# EAGLE board dw08a (EAGLE 6.6.0), part 1 of 4
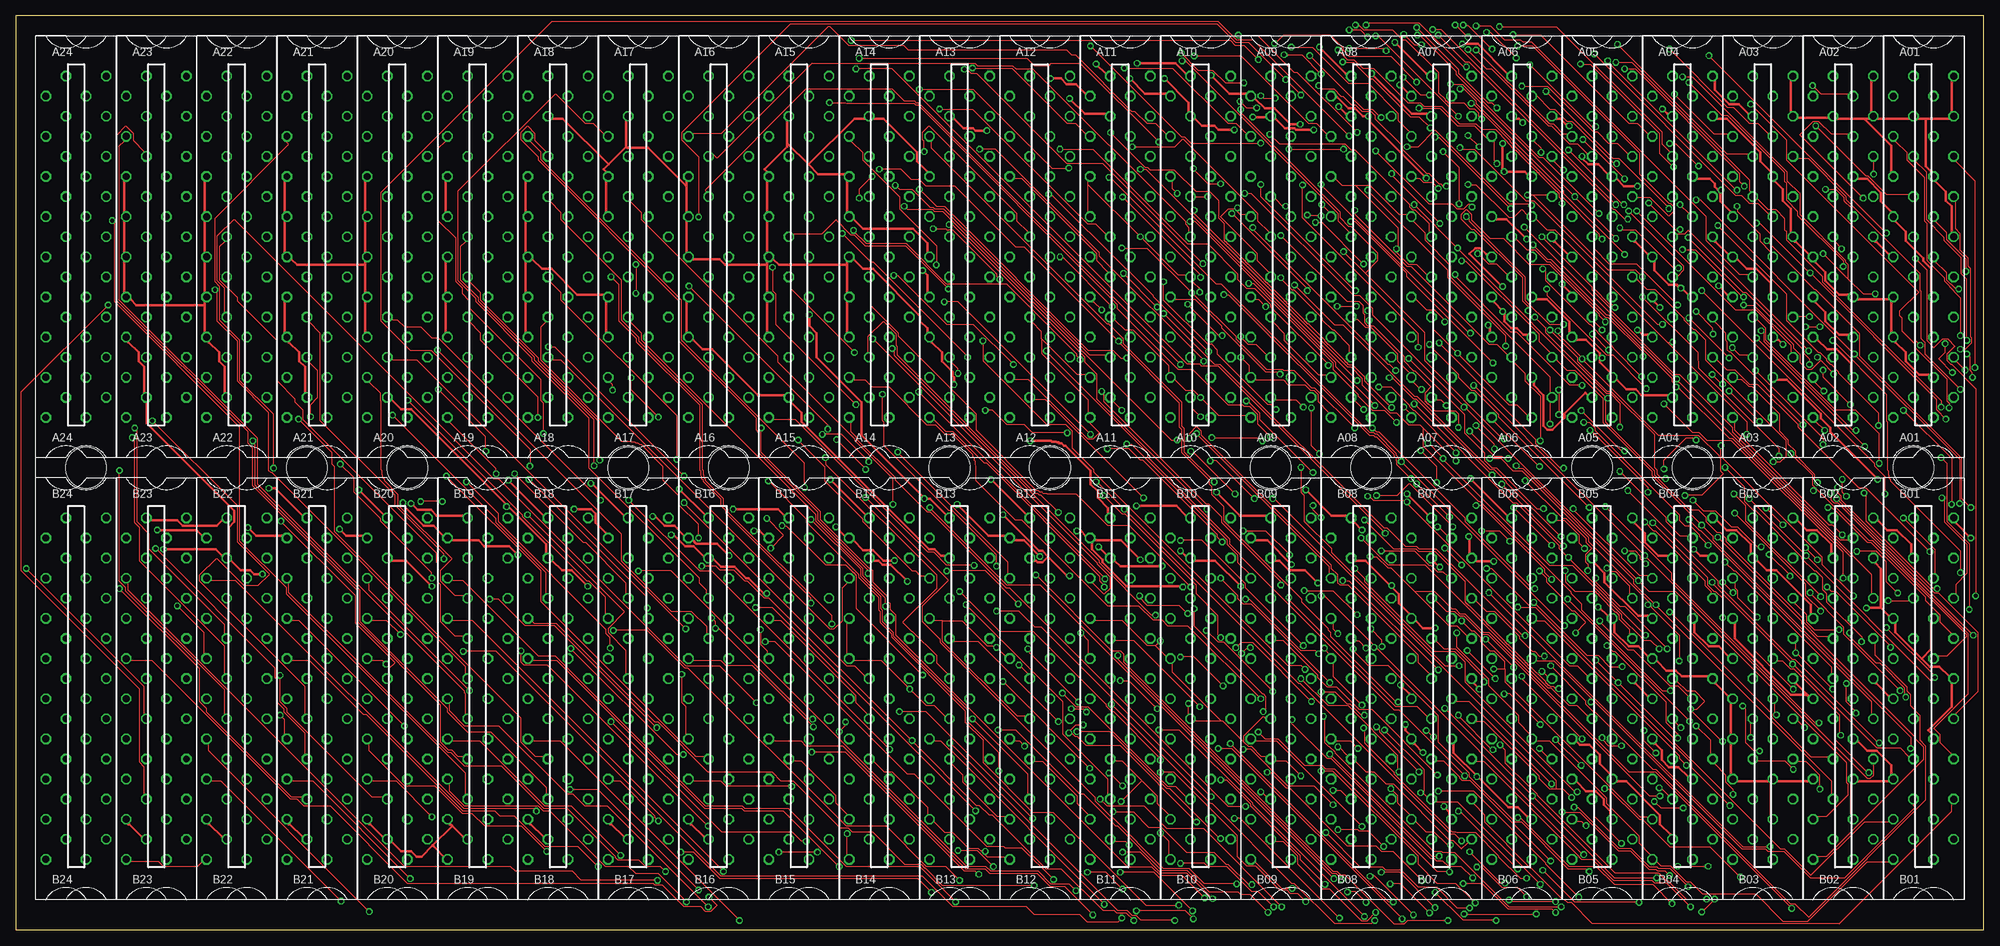
[diagram p6: board, top side]
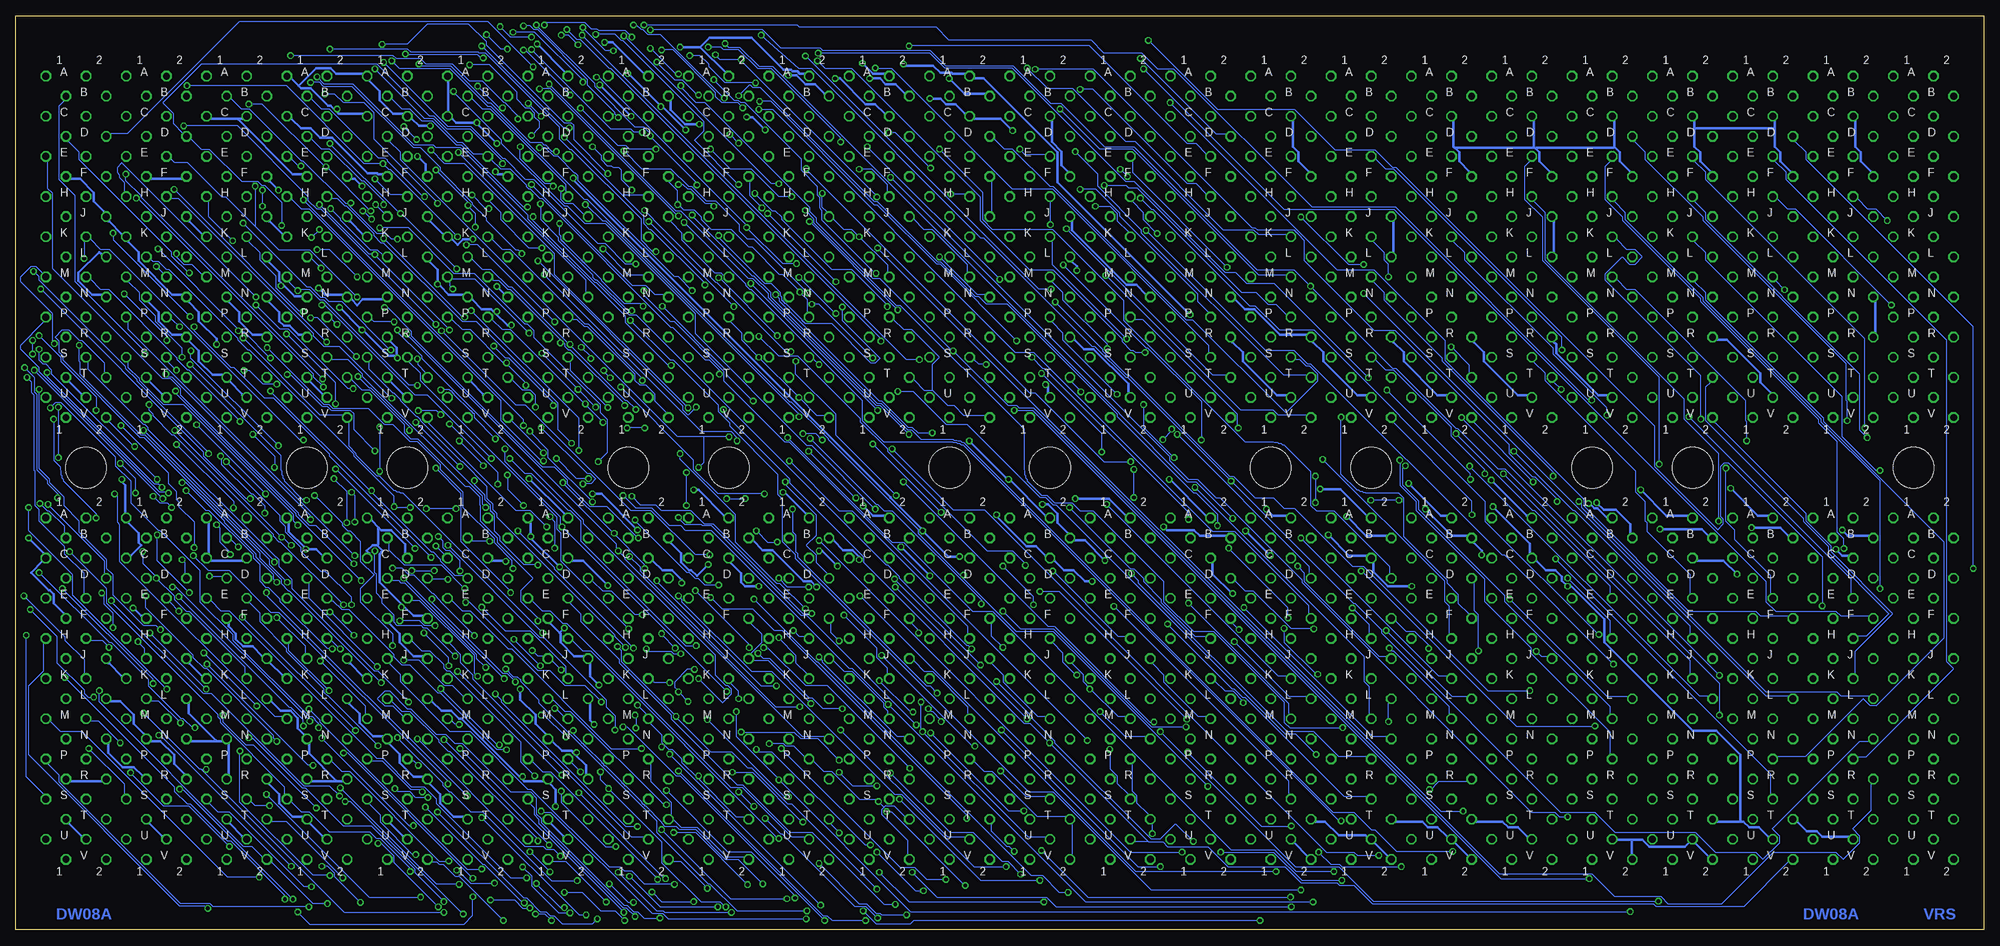
[diagram p7: board, bottom side, seen from below]

Size 311.15 x 144.46 mm. Coordinates in mm from the lower left corner, seen from the top.
Outline: 0,0 311.15,0 311.15,144.46 0,144.46 0,0
Copper layers (1*16): Top 0.035mm / dielectric 1.5mm / Bottom 0.035mm
Design rules "sierraproto": minimum track width 6mil, minimum drill 24mil, track to track 6mil, track to pad 6mil, pad to pad 10mil, via to via 6mil, smd to smd 6mil, copper to edge 25mil, drill to drill 10mil, minimum pad ring 10mil, minimum via ring 8mil, stop-mask expansion 0mil, vias tented up to drill 0mil, thermal gap 10mil
Net classes: 1 supply: width 0.381 mm

## Footprints (pad centres in the part's own frame; a part is rotated, then mirrored left to right if it is on the bottom)
H807 = drill 1.092 octagon: A1 4.763,28.575; A2 -1.587,28.575; B1 1.587,25.4; B2 -4.763,25.4; C1 4.763,22.225; C2 -1.587,22.225; D1 1.587,19.05; D2 -4.763,19.05; E1 4.763,15.875; E2 -1.587,15.875; F1 1.587,12.7; F2 -4.763,12.7; H1 4.763,9.525; H2 -1.587,9.525; J1 1.587,6.35; J2 -4.763,6.35; K1 4.763,3.175; K2 -1.587,3.175; L1 1.587,0; L2 -4.763,0; M1 4.763,-3.175; M2 -1.587,-3.175; N1 1.587,-6.35; N2 -4.763,-6.35; P1 4.763,-9.525; P2 -1.587,-9.525; R1 1.587,-12.7; R2 -4.763,-12.7; S1 4.763,-15.875; S2 -1.587,-15.875; T1 1.587,-19.05; T2 -4.763,-19.05; U1 4.763,-22.225; U2 -1.587,-22.225; V1 1.587,-25.4; V2 -4.763,-25.4
CBLOCK = hole 6.452: 7.938,68.263; 42.862,68.263

## Placement (x,y rotation side)
A01  M903  [H807]  301.62,106.36 0 top
A02  M903  [H807]  288.93,106.36 0 top
A03  M903  [H807]  276.23,106.36 0 top
A04  M903  [H807]  263.52,106.36 0 top
A05  M903  [H807]  250.82,106.36 0 top
A06  M907  [H807]  238.12,106.36 0 top
A07  M651  [H807]  225.43,106.36 0 top
A08  M651  [H807]  212.72,106.36 0 top
A09  M651  [H807]  200.03,106.36 0 top
A10  M651  [H807]  187.32,106.36 0 top
A11  M651  [H807]  174.62,106.36 0 top
A12  M651  [H807]  161.93,106.36 0 top
A13  W011  [H807]  149.22,106.36 0 top
A14  W011  [H807]  136.53,106.36 0 top
A15  W011  [H807]  123.83,106.36 0 top
A16  W011  [H807]  111.12,106.36 0 top
A17  W011  [H807]  98.42,106.36 0 top
A18  W011  [H807]  85.72,106.36 0 top
A19  W011  [H807]  73.03,106.36 0 top
A20  W011  [H807]  60.33,106.36 0 top
A21  W011  [H807]  47.62,106.36 0 top
A22  W011  [H807]  34.92,106.36 0 top
A23  W011  [H807]  22.23,106.36 0 top
A24  H807  [H807]  9.53,106.36 0 top
B01  M903  [H807]  301.62,36.51 0 top
B02  M903  [H807]  288.93,36.51 0 top
B03  M903  [H807]  276.23,36.51 0 top
B04  M903  [H807]  263.52,36.51 0 top
B05  M903  [H807]  250.82,36.51 0 top
B06  M101  [H807]  238.12,36.51 0 top
B07  M907  [H807]  225.43,36.51 0 top
B08  M651  [H807]  212.72,36.51 0 top
B09  M651  [H807]  200.03,36.51 0 top
B10  M651  [H807]  187.32,36.51 0 top
B11  M651  [H807]  174.62,36.51 0 top
B12  M651  [H807]  161.93,36.51 0 top
B13  M651  [H807]  149.22,36.51 0 top
B14  M651  [H807]  136.53,36.51 0 top
B15  M651  [H807]  123.83,36.51 0 top
B16  M517  [H807]  111.12,36.51 0 top
B17  M517  [H807]  98.42,36.51 0 top
B18  M517  [H807]  85.72,36.51 0 top
B19  M517  [H807]  73.03,36.51 0 top
B20  M517  [H807]  60.33,36.51 0 top
B21  M517  [H807]  47.62,36.51 0 top
B22  M517  [H807]  34.92,36.51 0 top
B23  M517  [H807]  22.23,36.51 0 top
B24  H807  [H807]  9.53,36.51 0 top
U$1  [CBLOCK]  3.17,4.76 0 top
U$2  [CBLOCK]  53.98,4.76 0 top
U$3  [CBLOCK]  104.78,4.76 0 top
U$4  [CBLOCK]  155.57,4.76 0 top
U$5  [CBLOCK]  206.38,4.76 0 top
U$6  [CBLOCK]  257.18,4.76 0 top

## Tracks (layer width: path | path; a pad name or v marks a point on that pad's centre or on a via)
!I_MB03  (via drill 0.61)
  Top 0.152: v224.41,125.28 225.04,125.28 v236.35,113.98 | 239.9,116.14 242.19,116.14 A06.H1 | v239.01,116.14 239.9,116.14 | v242.7,41.72 248.28,36.13 248.28,35.62 249.43,34.48 249.68,34.48 258.83,25.34 259.33,25.34 280.54,4.13 281.31,4.13 283.46,1.97 302.01,20.51 302.01,29.02 301.12,29.91 301.12,33.85 299.59,35.37 299.59,37.15 299.08,37.66 299.08,38.29 294,43.37 294,45.28 B02.H1 | v246.63,46.93 248.28,48.58 246.51,50.35 246.13,50.35 244.6,51.88 244.6,52.39 242.06,54.93 242.06,55.56 v240.92,56.71 | v244.35,62.17 244.22,62.17 235.71,70.67 235.71,70.8 233.81,72.71 233.17,72.71 221.62,84.26 221.23,84.26 209.93,95.57 208.53,95.57 v202.18,101.92 | v273.18,100.01 273.05,100.01 265.56,107.5 v263.52,107.5 | v257.18,103.19 256.03,104.33 251.71,104.33 239.9,116.14
  Bottom 0.152: 215.26,116.14 211.84,116.14 A08.H2 | 215.26,116.14 v224.41,125.28 | v236.35,113.98 236.85,113.98 v239.01,116.14 | v242.7,41.72 242.7,42.99 v246.63,46.93 | v240.92,56.71 240.92,58.36 242.44,59.88 243.08,59.88 243.59,60.39 243.59,61.4 v244.35,62.17 | v202.18,101.92 202.18,102.17 210.69,110.68 210.95,110.68 211.84,111.57 211.84,112.71 215.26,116.14 | v273.18,100.01 294.39,121.22 295.15,120.46 295.15,119.7 294.77,119.32 294.77,118.94 294,118.17 294,116.65 A02.H1 | v263.52,107.5 261.49,107.5 v257.18,103.19
!I_MB04  (via drill 0.61)
  Top 0.152: v213.11,82.23 211.71,83.63 A08.U2 | v285.12,32.7 284.48,32.7 261.75,55.44 261.75,56.45 v251.33,66.86 | v223.52,92.52 223.52,92.39 228.09,87.82 228.09,87.31 230.12,85.28 230.63,85.28 234.44,81.47 234.44,81.09 v248.79,66.74
  Bottom 0.152: v213.11,82.23 214.5,83.63 214.76,83.63 223.52,92.39 | 223.52,92.39 232.66,101.54 233.17,101.54 235.97,104.33 237.36,104.33 239.01,105.98 A06.L1 | v285.12,32.7 288.54,36.13 289.81,36.13 B02.L1 | A02.L1 289.81,105.98 289.43,105.6 288.54,105.6 287.27,104.33 286.89,104.33 275.97,93.41 275.97,93.15 274.45,91.63 274.19,91.63 257.68,75.12 257.68,74.87 251.33,68.52 v251.33,66.86 250.95,66.74 v248.79,66.74 | 223.52,92.39 v223.52,92.52
!I_MB05  (via drill 0.61)
  Top 0.152: v197.61,98.49 196.47,99.63 195.96,99.63 A09.N2 | v211.07,111.95 211.71,111.95 219.84,103.82 219.84,103.31 v233.55,89.6 | v230.5,86.04 246.89,69.66 247.01,69.66 v257.56,59.12 292.74,23.94 293.24,23.94 293.75,24.45 293.75,26.23 B02.P1
  Bottom 0.152: v197.61,98.49 v211.07,111.95 | A06.P1 242.19,96.46 240.54,94.81 239.27,94.81 234.06,89.6 v233.55,89.6 233.3,89.22 230.5,86.42 v230.5,86.04 | v257.56,59.12 293.37,94.93 293.37,96.08 A02.P1
!I_MB06  (via drill 0.61)
  Top 0.152: v201.29,123.38 v209.93,123.38 | v221.87,129.86 225.17,129.86 227.97,127.06 230.63,127.06 232.66,125.03 A06.D2 233.68,124.65 233.68,121.6 v234.19,121.09 | A10.H2 v188.47,115.89 | v282.96,60.39 v284.86,58.48 | v294.51,79.69 294.51,81.72 288.16,88.08 288.16,88.2 287.02,89.34 286.89,89.34 286.26,89.98 286.26,90.23 285.24,91.25 284.99,91.25 279.91,96.33 279.91,100.52 v269.11,111.32
  Bottom 0.152: v188.47,115.89 190.5,115.89 194.82,120.21 198.12,120.21 v201.29,123.38 | v209.93,123.38 214.12,123.38 214.63,123.89 215.9,123.89 v221.87,129.86 | v284.86,58.48 284.48,58.1 284.48,56.33 B02.D2 | v282.96,60.39 282.96,64.45 285.37,66.86 285.37,67.63 285.75,68.01 285.75,69.28 287.02,70.55 287.02,72.2 v294.51,79.69 | v269.11,111.32 269.11,115 271.78,117.67 272.29,117.67 272.92,118.3 275.46,118.3 280.54,123.38 281.81,123.38 283.46,125.03 A02.D2 284.73,125.92 286.26,127.44 286.26,129.09 287.91,130.75 281.81,136.84 254,136.84 245.75,128.59 244.98,128.59 242.95,126.56 239.27,126.56 234.19,121.47 v234.19,121.09
!I_MB07  (via drill 0.61)
  Top 0.152: v187.32,81.09 186.06,82.36 186.06,83.38 A10.U2 | v221.11,114.62 v227.97,107.76 228.22,107.38 251.33,84.26 251.33,84.01 | 251.33,84.01 251.33,80.33 259.08,72.58 259.08,71.94 264.67,66.36 266.06,66.36 267.21,65.22 267.21,64.58 268.99,62.8 269.49,62.8 270.38,61.91 270.38,61.4 282.7,49.09 282.7,48.58 284.86,46.42 286.64,46.42 B02.H2 | 251.33,84.01 v251.71,84.01
  Bottom 0.152: v187.32,81.09 187.32,81.47 217.81,111.95 218.31,111.95 220.98,114.62 v221.11,114.62 | v227.97,107.76 230,107.76 234.44,112.2 234.44,113.35 236.22,115.13 A06.H2 | v251.71,84.01 251.84,84.01 259.97,92.14 262.38,92.14 264.03,93.79 264.03,94.17 285.37,115.51 286.64,115.51 A02.H2
!I_MB08  (via drill 0.61)
  Top 0.152: v171.7,97.98 170.31,99.38 A11.N2 | v185.67,111.95 186.44,111.95 208.66,89.72 208.66,89.09 v214.88,82.87 | v292.99,24.83 292.86,24.83 287.65,30.04 287.65,32.58 B02.M2 | v277.37,13.14 273.05,13.14 v232.92,53.28 | v244.73,72.96 244.22,72.96 240.28,76.9 240.28,77.53 v225.04,92.77 | v288.93,104.84 288.93,105.73 281.69,112.97 281.69,113.6 279.91,115.38 279.91,118.05 279.65,118.3 279.65,119.7 270.64,128.71 269.75,128.71 v264.54,133.92 | v231.14,106.87 231.27,106.87 232.92,105.22 234.19,105.22 235.84,103.57 A06.M2
  Bottom 0.152: v171.7,97.98 v185.67,111.95 | v214.88,82.87 214.88,83.12 223.39,91.63 223.77,91.63 224.28,92.14 224.28,92.52 224.79,93.03 | 224.79,93.03 232.92,101.16 233.3,101.16 234.7,102.55 235.59,102.55 235.84,102.81 A06.M2 | v292.99,24.83 292.99,24.7 287.78,19.49 283.72,19.49 v277.37,13.14 | v232.92,53.28 232.92,53.53 240.79,61.4 240.79,69.03 v244.73,72.96 | 224.79,93.03 v225.04,92.77 | v288.93,104.84 287.91,103.82 287.91,103.69 A02.M2 | v264.54,133.92 263.14,133.92 262.51,133.29 257.94,133.29 248.28,123.64 247.14,123.64 243.97,120.46 243.97,119.95 238.89,114.87 238.89,114.62 236.73,112.46 236.73,112.08 232.03,107.38 231.65,107.38 v231.14,106.87
!O_MB03  (via drill 0.61)
  Top 0.152: v147.45,101.28 140.72,108.01 134.37,108.01 132.59,109.79 132.08,109.79 129.67,112.2 127.38,109.92 122.94,109.92 A15.K2 | v186.31,138.11 193.68,138.11 204.34,127.44 205.61,127.44 207.26,125.79 A08.D2
  Bottom 0.152: v147.45,101.28 149.48,101.28 v186.31,138.11
!O_MB04  (via drill 0.61)
  Top 0.152: v200.03,103.06 200.03,102.93 201.8,101.16 202.06,101.16 206.5,96.71 206.5,96.46 208.15,94.81 208.41,94.81 210.82,92.39 210.82,91.25 A08.S2 | v190.75,93.92 190.25,93.92 v185.29,98.87 | v175.64,90.36 174.75,90.36 173.48,91.63 169.54,91.63 146.81,114.36 145.54,114.36 v142.88,117.03
  Bottom 0.152: v200.03,103.06 199.9,103.06 v190.75,93.92 | v185.29,98.87 184.15,98.87 v175.64,90.36 | v142.88,117.03 140.34,117.03 136.65,113.35 136.65,112.84 124.33,100.52 124.33,99.38 122.56,97.6 A15.P2
!O_MB05  (via drill 0.61)
  Top 0.152: v145.03,110.81 147.07,110.81 147.19,110.68 148.08,110.68 155.07,103.69 155.07,103.31 v155.57,102.81 | v176.53,123.76 183.26,123.76 184.53,125.03 196.34,113.22 196.34,112.08 198.12,110.3 A09.K2
  Bottom 0.152: v145.03,110.81 121.92,87.69 119.76,87.69 A15.T2 | v155.57,102.81 v176.53,123.76
!O_MB06
  Top 0.152: A16.D2 107.06,125.86 111.51,125.86 128.4,142.75 128.78,142.75 131.7,139.83 140.34,139.83 141.1,139.06 166.12,139.06 166.88,138.3 167.51,138.3 176.4,129.41 176.91,129.41 178.82,127.51 180.21,127.51 181.86,125.86 A10.D2
!O_MB07  (via drill 0.61)
  Top 0.152: v184.15,89.34 142.75,130.75 142.37,130.75 142.11,131 140.46,131 138.56,132.91 124.97,132.91 108.97,116.9 109.22,116.65 A16.H2
  Bottom 0.152: v184.15,89.34 184.91,90.11 185.04,90.11 A10.S2
!O_MB08  (via drill 0.61)
  Top 0.152: v146.05,129.73 151.26,129.73 169.42,111.57 170.69,111.57 172.34,109.92 A11.K2
  Bottom 0.152: v146.05,129.73 139.7,123.38 134.49,123.38 114.68,103.57 110.24,103.57 A16.M2
-15V  (via drill 0.61)
  Top 0.381: v22.35,63.18 28.57,63.18 29.46,62.29 B22.B2 | v36.7,63.56 37.97,62.29 42.16,62.29 B21.B2 | v51.18,63.31 52.2,62.29 54.86,62.29 B20.B2 | v79.38,59.24 77.98,60.64 74.04,60.64 73.15,61.53 68.96,61.53 B19.B2 67.56,62.29 66.04,63.82 64.52,63.82 61.21,67.12 v61.21,67.5 | v100.71,65.34 101.09,65.34 102.62,63.82 104.14,63.82 105.66,62.29 B16.B2 107.06,61.53 107.57,61.02 110.87,61.02 v112.78,59.12 | v88.27,66.48 90.93,66.48 91.69,65.72 91.69,64.33 93.34,62.67 B17.B2 | v163.58,134.56 165.23,134.56 166.12,133.67 167.64,133.67 169.16,132.14 A11.B2 | v176.15,134.56 178.56,132.14 181.86,132.14 A10.B2 | v188.98,135.06 191.9,132.14 194.56,132.14 A09.B2 195.96,131.38 197.49,129.86 199.01,129.86 201.55,127.32 v203.07,127.32 | v218.82,133.54 220.09,132.27 A07.B2 | A08.B2 208.66,131.89 210.69,129.86 211.71,129.86 212.98,128.59 v213.87,128.59 214.12,128.21 214.12,127.7 v223.01,118.81 | v129.67,63.69 131.06,62.29 B14.B2 132.46,61.53 133.99,60.01 135.51,60.01 137.16,58.36 v138.94,58.36 | v148.84,67.25 153.8,62.29 156.46,62.29 B12.B2 157.86,61.53 159.38,61.53 v161.93,58.99 | v177.8,58.48 174.75,61.53 170.56,61.53 B11.B2 | v201.68,57.72 197.87,61.53 195.96,61.53 B09.B2 | v184.53,54.17 184.4,54.29 175.64,54.29 171.83,58.1 171.83,58.48 170.18,60.13 170.18,61.15 B11.B2 | v167.77,63.06 168.4,63.06 169.16,62.29 B11.B2 | v116.71,63.06 117.6,63.06 118.36,62.29 B15.B2
  Bottom 0.381: v22.35,63.18 21.46,62.29 18.16,62.29 B23.B2 | v36.7,63.56 32.13,63.56 30.86,62.29 B22.B2 | v51.18,63.31 44.58,63.31 43.56,62.29 B21.B2 | v79.38,59.24 79.38,59.88 80.64,61.15 B18.B2 81.66,62.29 84.07,62.29 v88.27,66.48 | v100.71,65.34 97.66,62.29 94.36,62.29 B17.B2 | v61.21,67.5 60.07,66.36 58.17,66.36 55.88,64.07 55.88,62.67 B20.B2 | v163.58,134.56 161.16,132.14 157.86,132.14 A12.B2 | v176.15,134.56 174.5,134.56 173.61,133.67 172.09,133.67 170.56,132.14 A11.B2 | v188.98,135.06 187.71,135.06 186.31,133.67 184.78,133.67 183.26,132.14 A10.B2 | v203.07,127.32 205.36,127.32 207.65,129.6 207.65,131 A08.B2 | v213.87,128.59 v218.82,133.54 | v129.67,63.69 129.16,63.18 124.84,63.18 123.95,62.29 119.76,62.29 B15.B2 | v138.94,58.36 142.11,61.53 143.76,61.53 B13.B2 144.78,62.67 146.43,64.33 146.43,65.72 147.96,67.25 v148.84,67.25 | v177.8,58.48 177.8,58.99 178.82,60.01 180.34,60.01 181.86,61.53 B10.B2 | v201.68,57.72 203.45,55.94 204.34,56.83 204.72,56.83 205.99,58.1 205.99,59.5 207.65,61.15 B08.B2 | v184.53,54.17 185.42,55.05 186.56,55.05 191.52,60.01 193.04,60.01 194.56,61.53 B09.B2 | v161.93,58.99 163.7,58.99 v167.77,63.06 168.02,63.44 172.85,68.26 172.85,68.39 223.01,118.56 v223.01,118.81 | v116.71,63.06 v112.78,59.12
A06U1  (via drill 0.61)
  Top 0.152: v183.64,116.39 182.88,117.16 182.88,118.3 A10.F2 | A12.F2 157.86,118.68 159.13,118.68 170.94,106.87 170.94,105.73 172.72,103.95 A11.M2 | v187.2,100.78 187.2,101.28 186.06,102.42 A10.M2 185.04,103.57 183.77,103.57 v177.8,109.54 169.54,117.79 | 169.54,117.79 169.54,113.47 A11.J2 | 169.54,117.79 169.54,118.3 A11.F2 | v234.95,70.42 v244.73,60.64 | v242.57,79.95 242.57,83.38 A06.U1 242.57,84.9 242.57,87.44 226.82,103.19 226.82,104.97 222.76,109.03 222.76,110.17 220.98,111.95 A07.J2 219.96,113.09 218.69,113.09 214.12,117.67 211.84,117.67 | 193.17,113.47 192.66,113.98 191.77,113.98 190.5,112.71 196.34,106.87 196.34,105.73 198.12,103.95 A09.M2 | 193.17,113.47 193.55,113.09 194.56,113.09 A09.J2 | 193.17,113.47 v193.17,114.11 | A07.M2 223.14,103.57 221.49,105.22 220.22,105.22 218.31,107.12 v218.31,107.63 218.57,108.01 218.57,110.93 211.84,117.67 | 211.84,117.67 209.68,117.67 208.66,118.68 A08.F2 | v224.92,117.16 224.03,118.05 222.63,118.05 222,118.68 221.36,118.68 A07.F2 | v206.5,114.62 207.65,113.47 A08.J2
  Bottom 0.152: A12.J2 156.84,113.47 156.84,118.3 A12.F2 | A11.M2 173.35,103.95 173.35,105.09 v177.8,109.54 178.94,110.68 180.21,110.68 181.86,112.33 A10.J2 182.88,113.47 183.64,114.24 v183.64,116.39 | A10.P2 186.06,97.6 186.06,99.63 v187.2,100.78 187.45,101.16 189.87,103.57 190.37,103.57 194.69,107.89 195.2,107.89 197.99,110.68 201.17,110.68 202.69,112.2 202.69,112.58 203.84,113.73 205.49,113.73 206.12,114.36 v206.5,114.62 206.5,116.78 208.03,118.3 A08.F2 | A12.M2 160.66,103.95 160.66,105.09 166.24,110.68 167.51,110.68 169.16,112.33 A11.J2 | v244.73,60.64 243.46,59.37 243.46,59.24 B06.C1 | v234.95,70.42 234.95,72.33 v242.57,79.95 | A09.M2 199.14,103.57 199.39,103.57 199.64,103.82 200.66,103.82 205.87,109.03 205.87,110.17 207.65,111.95 A08.J2 | v193.17,114.11 195.07,116.01 195.07,118.3 A09.F2 | v218.31,107.63 214.25,103.57 211.84,103.57 A08.M2 | v224.92,117.16 224.92,115.38 224.28,114.75 223.01,114.75 221.36,113.09 A07.J2
A06V1  (via drill 0.61)
  Top 0.152: v219.46,82.61 220.34,81.72 A07.V2 | v222.25,85.41 222.12,85.41 220.98,86.55 A07.T2 220.34,88.08 218.57,89.85 218.57,91 214.38,95.19 213.49,95.19 212.22,96.46 211.84,96.46 A08.P2 | A07.P2 224.16,96.08 224.16,94.93 v227.97,91.12 236.09,83 237.36,83 239.01,81.34 A06.V1 | A08.V2 207.65,81.72 205.87,83.5 205.87,84.64 205.23,85.28 204.72,85.28 203.84,86.17 201.17,86.17 200.41,86.93 195.96,86.93 A09.T2 194.94,88.08 194.94,89.22 v193.68,90.49 | A08.T2 207.26,87.69 205.99,87.69 200.53,93.15 200.53,94.3 198.75,96.08 A09.P2 | 162.18,93.41 162.18,94.55 160.66,96.08 A12.P2 | 162.18,93.41 162.18,91.12 169.54,83.76 169.54,81.72 A11.V2 169.67,80.2 171.32,78.55 170.31,77.53 169.54,77.53 160.15,86.93 157.86,86.93 A12.T2 | 162.18,93.41 167.89,87.69 169.16,87.69 A11.T2 | A11.P2 173.74,96.46 175.39,94.81 176.66,94.81 182.25,89.22 182.25,88.08 A10.T2 183.26,86.93 184.91,85.28 186.18,85.28 v187.32,84.14 190.12,81.34 194.56,81.34 A09.V2
  Bottom 0.152: v219.46,82.61 v222.25,85.41 222.63,85.66 222.63,85.79 v227.97,91.12 | A10.V2 183.26,81.34 184.53,81.34 v187.32,84.14 v193.68,90.49 196.34,93.15 196.34,94.3 198.12,96.08 A09.P2 | 166.24,85.28 163.83,82.87 162.81,82.87 161.29,81.34 157.86,81.34 A12.V2 | 166.24,85.28 167.51,85.28 169.16,86.93 A11.T2 | 166.24,85.28 166.24,89.34 165.1,90.49 169.42,94.81 170.69,94.81 172.34,96.46 A11.P2 | A07.P2 223.14,96.46 222.38,96.46 221.23,95.31 220.73,95.31 213.23,87.82 213.23,86.81 212.47,86.04 211.46,86.04 210.06,84.64 210.06,83.5 208.28,81.72 A08.V2
B07U1  (via drill 0.61)
  Top 0.152: v117.73,47.43 117.73,45.15 118.75,44.13 118.75,43.62 B15.J2 | B15.F2 119.76,48.83 121.03,48.83 132.84,37.02 132.84,35.88 134.62,34.1 B14.M2 | B14.F2 131.44,48.45 131.44,43.62 B14.J2 132.46,42.48 136.91,42.48 v141.35,38.04 144.02,35.37 145.29,35.37 146.94,33.72 B13.M2 | 146.56,48.83 149.61,48.83 153.54,44.9 154.81,44.9 v155.07,44.64 156.46,43.24 B12.J2 | 146.56,48.83 145.16,48.83 B13.F2 | 146.56,48.83 146.56,45.53 158.37,33.72 159.64,33.72 B12.M2 | 180.21,44.9 178.94,44.9 175.01,48.83 170.56,48.83 B11.F2 | 180.21,44.9 181.86,43.24 B10.J2 182.88,42.1 182.88,40.7 190.63,32.96 | 180.21,44.9 v180.97,45.66 | 194.18,29.65 194.94,28.89 195.45,28.89 196.98,27.37 197.74,27.37 B09.P2 199.14,26.61 200.91,26.61 v203.2,24.32 | 194.18,29.65 194.18,30.67 197.23,33.72 197.74,33.21 B09.M2 | 190.63,32.96 190.88,32.96 194.18,29.65 | 190.63,32.96 186.44,32.96 B10.M2 185.42,34.1 v185.42,35.75 | v212.85,35.5 208.28,40.07 208.28,42.1 B08.J2 207.65,43.62 206.88,44.39 v206.88,44.51 | v209.04,46.8 208.28,47.56 208.28,48.45 B08.F2 | v201.8,6.54 200.15,6.54 195.96,10.73 B09.V2 | B07.U1 229.62,13.78 228.6,12.76 227.2,14.16 226.69,14.16 217.81,23.05 216.66,23.05 214.76,24.96 213.49,24.96 211.84,26.61 B08.P2 210.57,27.5 209.17,28.89 v209.04,28.89 | v168.4,46.93 169.54,45.78 169.54,43.62 B11.J2
  Bottom 0.152: v117.73,47.43 118.75,48.45 B15.F2 | 141.22,38.04 142.37,39.18 142.37,40.32 144.15,42.1 B13.J2 | 141.22,38.04 136.91,33.72 135.64,33.72 B14.M2 | B15.M2 122.94,33.72 124.21,33.72 129.67,39.18 129.67,40.32 131.44,42.1 B14.J2 | B12.M2 160.66,34.1 160.66,35.24 166.24,40.83 167.51,40.83 169.16,42.48 B11.J2 | B13.M2 148.34,33.72 149.61,33.72 155.07,39.18 155.07,40.32 156.84,42.1 B12.J2 | v155.07,44.64 156.84,46.42 156.84,48.45 B12.F2 | v141.35,38.04 141.22,38.04 | B11.M2 173.35,34.1 173.35,34.61 173.99,35.24 173.99,35.88 178.94,40.83 180.21,40.83 181.86,42.48 B10.J2 | v180.97,45.66 182.25,46.93 182.25,48.45 B10.F2 | B09.F2 194.94,48.45 193.17,46.67 193.17,45.4 194.94,43.62 B09.J2 194.56,42.48 192.15,42.48 v185.42,35.75 | 203.45,24.07 205.87,26.48 205.87,26.99 207.39,28.51 207.9,28.51 208.66,29.27 | 203.45,24.07 197.23,17.84 195.96,17.84 B09.T2 | 208.66,29.27 209.04,29.65 209.04,30.8 210.82,32.58 B08.M2 211.46,34.1 v212.85,35.5 | v209.04,46.8 209.04,46.67 v206.88,44.51 | B09.V2 195.96,11.49 198.75,11.49 203.45,16.19 205.99,16.19 207.26,17.46 B08.T2 207.52,18.1 207.52,20.13 210.82,23.43 210.82,26.23 B08.P2 | v201.8,6.54 205.99,10.73 207.26,10.73 B08.V2 | 208.66,29.27 v209.04,28.89 | 203.45,24.07 v203.2,24.32 | v168.4,46.93 168.4,47.31 169.54,48.45 B11.F2
B07V1  (via drill 0.61)
  Top 0.152: B12.T2 156.46,17.84 155.19,17.84 149.73,23.3 149.73,24.45 147.96,26.23 B13.P2 | 152.65,12.38 152.15,12.89 150.62,12.89 148.08,15.43 146.81,15.43 145.16,17.08 B13.T2 144.15,18.22 144.15,19.37 138.56,24.96 137.29,24.96 135.64,26.61 B14.P2 | 152.65,12.38 153.54,11.49 156.46,11.49 B12.V2 | v131.44,15.18 131.44,11.87 B14.V2 | B15.P2 122.94,26.61 124.21,26.61 129.67,21.14 129.67,20 131.44,18.22 B14.T2 | 152.65,12.38 v153.29,12.38 | v180.97,15.3 182.25,14.03 182.25,11.87 B10.V2 | 178.05,23.56 180.47,21.14 180.47,20 182.25,18.22 B10.T2 | 178.05,23.56 175.01,26.61 173.74,26.61 B11.P2 | B12.P2 161.04,26.61 162.31,26.61 167.77,21.14 167.77,20 169.54,18.22 B11.T2 | v174.75,20.26 178.05,23.56 | v217.81,4.38 217.04,4.38 v192.02,29.4
  Bottom 0.152: B13.V2 144.15,11.87 144.15,16.7 B13.T2 145.16,17.84 149.61,17.84 156.72,24.96 157.99,24.96 159.64,26.61 B12.P2 | v131.44,15.18 131.44,16.7 B14.T2 132.08,18.22 133.86,20 133.86,21.14 134.62,21.91 134.62,26.23 B14.P2 | v153.29,12.38 154.05,13.14 154.43,13.14 156.84,15.56 156.84,16.7 B12.T2 | v180.97,15.3 180.97,15.43 182.25,16.7 B10.T2 | 173.86,19.37 173.61,19.62 173.48,19.49 172.21,19.49 170.56,17.84 B11.T2 | 173.86,19.37 174.24,18.99 174.24,18.22 170.18,14.16 170.18,11.87 B11.V2 | 173.86,19.37 v174.75,20.26 175.13,20.51 177.67,20.51 182.12,24.96 183.39,24.96 185.04,26.61 B10.P2 186.44,27.37 188.09,29.02 189.36,29.02 189.74,29.4 v192.02,29.4 | v217.81,4.38 224.16,10.73 226.31,10.73 B07.V1
GND  (via drill 0.61)
  Top 0.381: A01.T1 302.51,87.69 300.99,87.69 298.83,89.85 298.83,91.25 297.18,92.9 A01.R2 296.55,94.42 296.55,99.25 A01.N2 296.16,99.63 291.21,99.63 A02.N1 289.81,100.39 288.29,100.39 286.13,102.55 286.13,103.95 284.48,105.6 A02.L2 283.46,106.74 281.43,108.78 281.31,108.78 A03.K1 280.67,110.3 280.67,113.98 279.4,115.25 279.4,117.03 278.13,118.3 A03.F1 277.5,119.83 275.84,121.47 275.84,122.87 270.51,128.21 268.99,128.21 A04.C1 | A02.T1 290.19,88.08 290.19,89.47 287.91,91.76 286.38,91.76 284.86,93.28 A02.R2 | v247.65,122.24 247.65,121.98 248.67,120.97 250.19,120.97 251.71,119.44 A05.F1 253.11,118.68 254.25,117.54 v256.41,117.54 | 235.14,97.79 233.68,99.25 A06.N2 | 235.14,97.79 235.33,97.6 235.33,96.2 236.47,95.06 237.36,95.06 238.38,94.04 239.01,94.04 A06.R1 | v235.08,101.66 229.87,106.87 230.76,107.76 231.52,107.76 232.54,106.74 232.66,106.74 A06.L2 | v232.79,95.57 233.04,95.31 233.04,94.42 A06.R2 | v244.47,102.04 245.75,100.78 A05.N2 | A06.K1 243.21,108.78 243.33,108.78 245.36,106.74 A05.L2 | v238.89,109.16 235.71,112.33 234.06,112.33 A06.J2 | v235.08,97.73 235.14,97.79 | 250.44,90.36 250.44,89.72 252.09,88.08 A05.T1 253.11,86.93 254.63,85.41 256.16,85.41 257.05,84.52 261.24,84.52 A04.U2 | 250.44,90.36 250.44,91.12 248.28,93.28 246.76,93.28 A05.R2 245.75,94.42 245.62,94.55 245.62,96.08 242.06,99.63 240.41,99.63 A06.N1 | v250.82,90.36 250.44,90.36 | v256.41,94.81 257.18,94.04 258.06,94.04 A04.R2 | A06.T1 240.03,86.55 240.03,86.04 241.55,84.52 241.55,79.69 242.19,79.06 242.95,79.06 244.86,80.96 244.86,81.6 248.16,84.9 248.54,84.52 A05.U2
  Top 0.381: A06.F1 239.01,119.44 238.63,119.83 v235.33,119.83 235.08,120.21 v235.08,124.27 | v238.25,127.57 237.62,128.21 237.24,128.21 A06.C2 | v260.35,129.73 261.11,128.97 261.24,128.97 A04.C2 | v245.62,127.06 245.36,127.32 245.11,127.32 244.22,128.21 243.59,128.21 A06.C1 | A05.K1 255.91,108.78 256.03,108.78 258.06,106.74 A04.L2 259.08,105.6 259.08,104.2 261.37,101.92 262.64,101.92 262.89,101.66 v263.27,101.41 263.4,101.41 264.41,100.39 A04.N1 | A04.K1 268.61,108.78 268.73,108.78 270.76,106.74 A03.L2 272.16,105.98 273.69,104.46 275.21,104.46 277.5,102.17 277.5,100.78 A03.N1 | 269.37,116.65 269.49,116.52 269.49,115.13 271.14,113.47 A03.J2 | 269.37,116.65 268.61,117.41 268.61,117.92 267.84,118.68 265.81,118.68 A04.F1 | 269.37,116.65 v269.62,116.9 | v269.24,101.79 270.64,100.39 270.76,100.39 A03.N2 | A03.A1 280.67,134.18 280.67,129.35 A03.C1 281.69,128.33 286.64,128.33 A02.C2 288.04,128.21 292.35,128.21 | A01.A1 306.07,134.18 306.07,129.35 A01.C1 305.69,128.21 302.01,128.21 | 292.35,128.21 292.99,128.21 A02.C1 | A02.A1 293.37,134.18 293.37,129.35 A02.C1 | A01.F2 296.55,119.83 296.55,123.89 292.35,128.08 292.35,128.21 | A02.C1 294.39,128.21 299.34,128.21 A01.C2 300.74,128.21 302.01,128.21 | v279.4,92.52 278.64,93.28 278.51,93.28 A03.R1 | A02.R1 289.81,94.04 288.29,94.04 286.13,96.2 286.13,97.6 284.48,99.25 A02.N2 | A01.R1 302.89,94.42 302.89,99.25 A01.N1 302.89,100.78 302.89,104.46 301.62,105.73 301.62,106.11 298.83,108.9 298.83,110.3 297.18,111.95 A01.J2 296.55,113.47 294.89,115.13 294.89,116.52 292.74,118.68 291.21,118.68 A02.F1 | A02.K1 294,108.78 294.13,108.78 296.16,106.74 A01.L2
  Top 0.381: A01.K1 306.07,110.3 306.07,114.36 305.18,115.25 305.18,116.65 303.53,118.3 A01.F1 302.89,119.83 302.01,120.71 302.01,128.21 | A04.A1 268.61,134.18 268.61,132.78 270.89,130.49 272.42,130.49 273.94,128.97 A03.C2 | v259.97,98.36 259.08,99.25 A04.N2 | B05.N2 246.76,29.78 247.27,29.27 248.79,29.27 250.44,27.62 250.44,26.23 252.09,24.57 B05.R1 253.11,23.43 254.63,23.43 259.97,18.1 259.97,16.7 261.62,15.05 B04.U2 | B04.N2 259.08,29.4 259.21,29.4 260.22,28.38 260.22,26.86 261.37,25.72 262.89,25.72 264.41,24.19 B04.R1 | B04.F1 265.43,48.45 265.43,47.05 267.72,44.77 269.24,44.77 270.76,43.24 B03.J2 | 294.89,50.86 v292.61,50.86 | 294.89,50.86 296.16,49.59 B01.F2 297.18,48.45 297.18,47.05 301.37,42.86 | B01.C2 299.72,59.5 299.72,60.9 297.43,63.18 295.91,63.18 294.39,64.71 B02.A1 | 294.89,50.86 294.89,57.09 294,57.98 B02.C1 | 301.37,42.86 302.89,44.39 302.89,48.45 B01.F1 | 301.37,42.86 302.64,41.59 304.17,41.59 305.69,40.07 B01.K1 306.07,38.92 306.07,35.24 302.39,31.56 303.02,30.92 B01.N1 302.89,29.4 302.89,24.57 B01.R1 302.89,23.05 302.89,18.22 B01.T1 | v309.12,61.91 306.7,64.33 B01.A1 | B02.T1 290.19,18.22 290.19,23.05 B02.R1 291.21,23.43 296.16,23.43 B01.R2 296.55,24.57 296.55,25.97 294.26,28.26 292.74,28.26 291.21,29.78 B02.N1 | 283.08,37.15 283.21,37.15 283.46,36.89 B02.L2 | 283.08,37.15 280.67,37.15 271.78,46.04 271.78,48.45 B03.F2 | B03.K1 281.31,38.92 281.43,38.92 283.08,37.27 283.08,37.15 | B02.K1 294,38.92 294.13,38.92 296.16,36.89 B01.L2 | B03.R1 277.5,23.05 277.5,18.22 B03.T1 | B02.R2 283.46,23.43 278.51,23.43 B03.R1 | B03.R1 277.11,23.43 272.16,23.43 B03.R2 271.14,24.57 271.14,29.4 B03.N2 271.14,30.92 271.14,35.75 B03.L2 270.76,36.89 268.73,38.92 268.61,38.92 B04.K1 267.59,40.07 263.4,40.07 262.51,40.96 260.99,40.96 259.46,42.48 B04.J2 258.06,43.24 256.54,44.77 255.02,44.77 252.73,47.05 252.73,48.45 B05.F1 251.71,49.59 250.32,50.99 v250.19,50.99
  Top 0.381: v193.68,54.29 189.61,58.36 186.44,58.36 B10.C2 185.04,59.12 184.91,59.12 v184.15,59.88 | v229.74,62.17 229.87,62.04 229.87,59.5 B07.C1 230.89,58.36 231.01,58.23 v233.68,58.23 | 217.42,54.29 218.69,53.02 218.69,51.63 220.34,49.97 B07.F2 221.36,48.83 222.5,47.69 v224.41,47.69 | 217.42,54.29 213.36,58.36 211.84,58.36 B08.C2 | 217.42,54.29 v217.55,54.42 | v225.17,57.34 225.04,57.34 224.28,58.1 B07.C2 | v205.87,54.8 203.84,56.83 201.29,56.83 199.77,58.36 199.14,58.36 B09.C2 | B02.F2 283.85,49.97 283.85,51.37 278.38,56.83 276.86,56.83 275.34,58.36 B03.C2 274.32,59.5 274.32,60.9 272.03,63.18 270.51,63.18 268.99,64.71 B04.A1 | B02.C2 287.02,59.5 287.02,60.9 284.73,63.18 283.21,63.18 281.69,64.71 B03.A1 | B04.F2 258.06,49.59 256.54,49.59 251.21,54.93 251.21,56.33 249.56,57.98 B05.C2 | B04.C2 261.24,59.12 259.71,59.12 257.56,61.28 257.56,62.67 255.91,64.33 B05.A1 | v265.3,60.13 266.32,59.12 267.59,59.12 B04.C1 | v225.81,19.49 226.69,18.61 226.69,18.22 B07.T1 | v222.5,28 221.11,29.4 220.98,29.4 B07.N2 220.34,30.92 219.71,31.56 v219.71,32.45 | v231.39,38.04 230.5,38.92 B07.K1 | B05.T1 252.09,18.22 252.09,18.73 251.08,19.75 251.08,20.64 249.81,21.91 248.28,21.91 246.76,23.43 B05.R2 | B05.K1 255.91,38.92 256.03,38.92 258.06,36.89 B04.L2 | 231.08,24.26 235.97,19.37 237.49,19.37 239.01,17.84 B06.T1 | 231.08,24.26 227.33,28 227.33,29.4 B07.N1 | 231.08,24.26 v231.01,24.19 | v218.95,38.67 220.34,37.27 B07.L2 | v294.39,71.18 286.89,78.68 286.89,79.31 285.37,80.83 285.37,81.6 280.04,86.93 278.51,86.93 A03.T1 | A20.R2 55.24,94.42 55.24,99.25 A20.N2 55.24,100.78 55.24,105.09
  Top 0.381: 55.24,105.09 55.24,105.6 A20.L2 55.24,107.12 55.24,111.95 A20.J2 55.24,113.47 55.24,118.3 A20.F2 | A21.F2 42.55,118.3 42.55,113.47 A21.J2 42.55,111.95 42.55,107.12 A21.L2 43.56,105.98 44.45,105.09 55.24,105.09 | A21.N2 42.55,99.25 42.55,94.42 A21.R2 43.18,92.9 44.83,91.25 44.83,89.85 45.72,88.96 45.72,84.9 A21.U2 | 29.84,98.74 29.84,99.25 A22.N2 29.84,100.78 29.84,105.6 A22.L2 29.84,107.12 29.84,111.95 A22.J2 29.84,113.47 29.84,118.3 A22.F2 | 29.84,98.74 29.84,94.42 A22.R2 30.48,92.9 32.13,91.25 32.13,89.85 33.02,88.96 33.02,84.9 A22.U2 | v23.37,60.13 31.62,60.13 32.64,59.12 B22.C2 | v38.99,56.2 37.72,56.2 37.08,56.83 35.56,56.83 34.04,58.36 B22.C2 | A23.R2 17.78,92.9 19.43,91.25 19.43,89.85 20.32,88.96 20.32,84.9 A23.U2 20.7,83.38 20.7,80.07 34.54,66.23 34.54,64.45 33.66,63.56 33.66,59.5 B22.C2 | A23.F2 17.14,118.3 17.14,113.47 A23.J2 17.14,111.95 17.14,107.12 A23.L2 17.14,105.6 17.14,100.78 A23.N2 18.16,99.63 19.05,98.74 29.84,98.74 | B16.T2 106.68,16.7 106.81,16.7 108.84,14.67 B16.U2 | B17.T2 93.98,16.7 94.11,16.7 96.14,14.67 B17.U2 | B18.T2 81.28,16.7 81.41,16.7 83.44,14.67 B18.U2 | 68.99,16.41 70.74,14.67 B19.U2 | 68.99,16.41 68.71,16.7 68.58,16.7 B19.T2 | B20.T2 55.88,16.7 56.01,16.7 58.04,14.67 B20.U2 59.44,13.91 60.96,12.38 62.48,12.38 63.37,11.49 63.5,11.56 64.14,11.56 65.91,13.34 | B21.T2 43.18,16.7 43.31,16.7 45.34,14.67 B21.U2 | B23.T2 17.78,16.7 17.91,16.7 19.94,14.67 B23.U2 | B22.T2 30.48,16.7 30.61,16.7 32.64,14.67 B22.U2 | v103.63,62.42 104.01,62.42 105.79,60.64 107.19,60.64 108.84,58.99 B16.C2 110.24,58.61 111.51,57.34 113.67,57.34 115.44,55.56 115.82,55.56 118.24,53.15 v118.75,53.15
  Top 0.381: v65.79,54.29 61.72,58.36 59.44,58.36 B20.C2 | A19.R2 67.94,94.42 67.94,99.25 A19.N2 67.94,100.78 67.94,105.6 A19.L2 | A19.F2 67.94,118.3 67.94,113.47 A19.J2 | 77.72,66.99 62.48,82.23 60.96,82.23 59.44,83.76 A20.U2 | 77.72,66.99 83.82,60.9 83.82,59.5 B18.C2 84.84,58.36 86.36,56.83 87.88,56.83 v90.42,54.29 | 77.72,66.99 v77.6,66.86 | A13.F2 144.15,119.83 142.49,121.47 142.49,122.87 137.16,128.21 135.64,128.21 A14.C2 134.24,128.21 132.59,128.21 125.35,120.97 | v153.54,126.3 151.76,126.3 151.38,126.68 149.86,126.68 148.34,128.21 A13.C2 | v166.62,131.38 169.04,128.97 172.34,128.97 A11.C2 | v181.61,134.56 185.42,130.75 185.42,129.35 A10.C2 186.44,128.21 187.58,127.06 189.48,127.06 190.12,126.43 v192.66,126.43 | v195.58,128.46 197.74,128.46 A09.C2 199.14,128.21 200.66,126.68 202.18,126.68 202.44,126.43 v205.23,126.43 | v209.17,130.11 210.31,128.97 210.44,128.97 A08.C2 | v214.38,135.32 220.73,128.97 223.14,128.97 A07.C2 | A17.R2 93.34,94.42 93.34,99.25 A17.N2 92.96,100.39 88.77,100.39 84.71,104.46 83.19,104.46 81.66,105.98 A18.L2 | A18.R2 80.64,94.42 80.64,99.25 A18.N2 80.64,100.78 80.64,105.6 A18.L2 | A18.L2 80.64,107.12 80.64,111.95 A18.J2 80.64,113.47 80.64,118.3 A18.F2 | v140.97,55.05 138.3,57.72 137.03,57.72 136.4,58.36 135.64,58.36 B14.C2 | 163.19,58.99 162.31,58.1 161.54,58.1 161.29,58.36 161.04,58.36 B12.C2 | 163.19,58.99 162.31,59.88 161.8,59.88 v156.08,65.6 | v171.2,60.52 172.47,59.24 B11.C2 173.74,58.36 174.62,57.47 v181.23,57.47 | v166.62,55.94 166.24,55.94 163.19,58.99 | v148.34,86.17 148.34,87.31 148.08,87.57 148.08,88.2 146.43,89.85 146.43,91.25 144.78,92.9 A13.R2 144.15,94.42 144.15,95.06 143,96.2 143,96.97 135.51,104.46 133.99,104.46 132.46,105.98 A14.L2 131.44,105.6 131.44,105.09
  Top 0.381: A14.R2 131.44,94.42 131.44,99.25 A14.N2 131.44,100.78 131.44,105.09 | A16.N2 106.05,99.25 106.05,94.42 A16.R2 107.06,93.28 108.58,91.76 110.11,91.76 117.35,84.52 121.54,84.52 A15.U2 122.56,83.38 124.21,81.72 124.21,80.33 144.4,60.13 145.29,60.13 146.3,59.12 146.94,59.12 B13.C2 | A17.J2 93.34,113.47 93.34,118.3 A17.F2 93.34,119.83 92.96,120.21 93.73,120.97 | 96.52,123.76 96.52,127.83 A17.C2 | 96.52,123.76 93.73,120.97 | 106.05,117.67 106.05,113.47 A16.J2 106.05,111.95 106.05,107.12 A16.L2 107.06,105.98 111.25,105.98 112.14,105.09 118.75,105.09 | 106.05,117.67 106.05,118.3 A16.F2 | 96.52,123.76 96.65,123.64 99.95,123.64 105.92,117.67 106.05,117.67 | v143.38,104.2 144.15,103.44 144.15,100.78 A13.N2 | A15.R2 118.75,94.42 118.75,99.25 A15.N2 118.75,100.78 118.75,105.09 | 118.75,105.09 118.75,105.6 A15.L2 | A15.L2 118.75,107.12 118.75,111.95 A15.J2 118.75,113.47 118.75,118.3 A15.F2 118.75,119.83 118.36,120.21 121.92,123.76 121.92,124.27 | 121.92,124.27 121.92,127.83 A15.C2 | 125.35,120.97 122.05,124.27 121.92,124.27 | 125.35,120.97 126.87,119.44 131.06,119.44 A14.F2 131.44,118.3 131.44,113.47 A14.J2 132.46,112.33 133.99,110.81 141.86,110.81 144.15,108.52 144.15,107.12 A13.L2 | 131.44,105.09 120.65,105.09 119.76,105.98 A15.L2 | A18.C2 84.84,128.21 86.49,128.21 93.73,120.97 | 65.91,13.34 68.96,16.38 68.99,16.41 | B19.V2 68.2,11.18 68.07,11.18 66.04,13.21 65.91,13.34
  Bottom 0.381: A01.U2 300.74,84.52 300.74,84.64 302.77,86.68 A01.T1 | A02.U2 288.04,84.52 288.04,84.64 290.07,86.68 A02.T1 | A03.U2 275.34,84.52 275.34,84.64 277.37,86.68 A03.T1 278.51,87.69 280.04,87.69 282.19,89.85 282.19,91.5 283.72,93.03 A02.R2 284.86,94.04 286.38,94.04 288.54,96.2 288.54,97.6 290.19,99.25 A02.N1 | v247.65,122.24 246.38,120.97 246.38,119.83 A05.F2 | v256.41,117.54 257.56,118.68 258.06,118.68 A04.F2 | A02.J2 283.85,111.95 283.72,111.95 281.69,109.92 A03.K1 | A05.F1 253.11,119.44 253.87,119.44 254,119.57 255.52,119.57 261.11,125.16 263.02,125.16 264.54,126.68 266.06,126.68 267.59,128.21 A04.C1 | v235.08,101.66 233.93,100.52 A06.N2 | v232.79,95.57 233.43,95.57 235.33,97.47 | 235.33,97.47 235.97,98.11 237.49,98.11 239.01,99.63 A06.N1 240.41,100.39 242.7,100.39 244.09,101.79 v244.47,102.04 244.47,104.33 245.75,105.6 A05.L2 | v238.89,109.16 240.41,109.16 241.3,108.27 242.19,109.16 A06.K1 243.59,109.92 245.62,111.95 245.75,111.95 A05.J2 | 235.33,97.47 v235.08,97.73 | A04.U2 262.64,84.52 262.64,84.64 264.67,86.68 A04.T1 | A06.U2 237.24,84.52 237.24,84.64 239.27,86.68 A06.T1 | A05.U2 249.94,84.52 249.94,84.64 251.97,86.68 A05.T1 | A05.R1 251.97,93.03 250.95,92.01 250.95,90.49 v250.82,90.36 251.21,90.61 251.33,90.74 252.22,90.74 256.29,94.81 v256.41,94.81 256.79,95.06 256.79,95.19 v259.97,98.36 | v235.33,119.83 234.95,119.44 234.06,119.44 A06.F2 | A06.A1 242.82,134.18 242.82,129.35 A06.C1 242.19,128.21 241.55,127.57 v238.25,127.57 238,127.19 v235.08,124.27 | 260.6,129.48 261.37,130.24 261.75,130.24 264.54,133.03 266.06,133.03 266.45,133.41
  Bottom 0.381: 260.6,129.48 260.1,128.97 256.29,128.97 A05.C1 | 266.45,133.41 267.59,134.56 A04.A1 | 260.6,129.48 v260.35,129.73 | 266.45,133.41 263.65,136.21 261.37,136.21 260.48,135.32 256.29,135.32 A05.A1 255.27,134.18 253.62,132.52 253.62,131.13 251.46,128.97 249.94,128.97 A05.C2 248.54,128.21 247.4,127.06 v245.62,127.06 | A03.R2 272.16,94.04 273.69,94.04 275.84,96.2 275.84,97.6 277.5,99.25 A03.N1 | A04.R1 265.81,94.04 266.45,94.04 267.84,95.44 268.73,95.44 269.49,96.2 269.49,97.6 271.14,99.25 A03.N2 | A04.J2 258.44,111.95 258.32,111.95 256.29,109.92 A05.K1 | A05.N1 253.11,99.63 256.29,99.63 257.18,98.74 258.06,99.63 A04.N2 259.46,100.39 262.25,100.39 v263.27,101.41 | 268.99,102.04 269.49,102.55 269.49,103.95 271.14,105.6 A03.L2 | 268.99,102.04 267.08,100.14 265.81,100.14 A04.N1 | A03.J2 271.14,111.95 271.02,111.95 268.99,109.92 A04.K1 | v269.62,116.9 271.02,118.3 271.14,118.3 A03.F2 | 268.99,102.04 v269.24,101.79 | 275.97,128.21 280.29,128.21 A03.C1 | 275.97,128.21 275.34,128.21 A03.C2 | v279.4,92.52 279.4,93.41 282.19,96.2 282.19,97.6 283.85,99.25 A02.N2 284.86,100.39 286.38,100.39 291.72,105.73 291.72,107.12 293.37,108.78 A02.K1 294.39,109.92 296.42,111.95 296.55,111.95 A01.J2 297.18,113.47 298.83,115.13 298.83,116.52 300.99,118.68 302.51,118.68 A01.F1 | A02.F2 284.86,118.68 289.81,118.68 A02.F1 | A04.F1 265.81,119.44 267.33,119.44 275.97,128.08 275.97,128.21 | A01.N2 297.56,100.39 299.08,100.39 301.24,102.55 301.24,103.82 297.94,107.12 297.56,106.74 A01.L2 | B04.U2 262.64,14.67 262.64,14.8 264.67,16.83 B04.T1 265.81,17.84 267.33,17.84 269.49,20 269.49,21.4 271.14,23.05 B03.R2
  Bottom 0.381: 260.48,23.43 264.41,23.43 B04.R1 | 260.48,23.43 259.46,23.43 B04.R2 | 260.48,23.43 260.48,23.56 264.8,27.88 264.8,29.4 B04.N1 265.56,30.8 266.57,31.81 266.57,33.47 267.72,34.61 269.24,34.61 270.76,36.13 B03.L2 | B03.F1 277.5,48.45 277.5,47.94 276.35,46.8 276.35,45.91 275.21,44.77 273.69,44.77 272.16,43.24 B03.J2 271.02,42.23 268.99,40.2 268.99,40.07 B04.K1 | v292.61,50.86 291.34,49.59 291.21,49.59 B02.F1 | B02.C1 292.99,59.12 291.34,60.77 291.72,61.15 291.72,62.67 293.37,64.33 B02.A1 293.88,65.85 293.88,70.29 294.39,70.8 v294.39,71.18 | B01.F1 303.53,49.97 305.18,51.63 305.18,53.02 305.82,53.66 305.94,53.66 308.74,56.45 306.96,58.23 B01.C1 306.7,59.5 v309.12,61.91 | B01.U2 300.74,14.67 300.74,14.8 302.77,16.83 B01.T1 | B02.U2 288.04,14.67 288.04,14.8 290.07,16.83 B02.T1 | B01.N2 296.55,29.4 296.55,28 294.26,25.72 292.48,25.72 291.08,24.32 B02.R1 | B01.R1 302.51,23.43 297.56,23.43 B01.R2 | B02.J2 283.85,42.1 283.72,42.1 281.69,40.07 B03.K1 | B01.J2 296.55,42.1 296.42,42.1 294.39,40.07 B02.K1 | B03.U2 275.34,14.67 275.34,14.8 277.37,16.83 B03.T1 | B03.R1 277.5,24.57 277.5,29.4 B03.N1 278.51,29.78 279.53,29.78 | 279.53,29.78 283.46,29.78 B02.N2 | B02.R2 284.48,24.57 286.13,26.23 286.13,27.62 288.29,29.78 289.81,29.78 B02.N1 290.83,30.92 292.48,32.58 292.48,33.97 294.64,36.13 296.16,36.13 B01.L2 | B02.L2 283.85,35.75 283.85,34.23 279.53,29.91 279.53,29.78 | v193.68,54.29 195.83,54.29 196.47,54.93 196.47,56.33 198.12,57.98 B09.C2 | B07.A1 229.87,64.33 229.74,64.2 v229.74,62.17 229.49,61.78 229.49,61.66 v225.17,57.34 | v233.68,58.23 233.81,58.36 235.84,58.36 B06.C2
  Bottom 0.381: 225.17,46.93 226.69,48.45 B07.F1 | 225.17,46.93 225.04,46.8 225.04,45.4 222.88,43.24 221.36,43.24 B07.J2 220.34,42.1 220.34,40.07 v218.95,38.67 | v217.55,54.42 221.49,58.36 223.14,58.36 B07.C2 | v224.41,47.69 225.17,46.93 | v205.87,54.8 205.87,55.31 207.39,56.83 208.91,56.83 210.44,58.36 B08.C2 | B03.C2 275.34,58.36 280.29,58.36 B03.C1 280.67,59.5 280.67,64.33 B03.A1 | 249.94,51.24 253.62,54.93 253.62,59.37 253.11,59.88 254,60.77 | 249.94,51.24 248.28,49.59 246.76,49.59 B05.F2 | 254,60.77 254.76,60.77 255.65,59.88 255.27,59.5 B05.C1 | 253.75,63.56 254.89,64.71 B05.A1 | 253.75,63.56 253.37,63.18 251.84,63.18 249.56,60.9 249.56,59.5 B05.C2 | B04.C2 262.64,59.12 263.65,60.13 v265.3,60.13 265.56,60.52 267.97,62.93 267.97,64.33 B04.A1 | 254,60.77 253.87,60.9 253.87,63.44 253.75,63.56 | B07.U2 224.54,14.67 224.54,14.8 226.57,16.83 B07.T1 | 231.27,23.94 240.66,33.34 241.05,33.34 242.32,34.61 243.84,34.61 245.36,36.13 B05.L2 | 231.27,23.94 230.76,23.43 227.71,23.43 B07.R1 226.69,23.05 225.81,22.16 v225.81,19.49 | 222.76,27.75 223.27,28.26 224.79,28.26 226.31,29.78 B07.N1 227.33,30.92 228.98,32.58 228.98,33.97 231.39,36.39 v231.39,38.04 | 222.76,27.75 220.98,25.97 220.98,24.57 B07.R2 | v222.5,28 222.76,27.75 | v219.71,32.45 220.34,33.08 220.34,35.75 B07.L2 | B05.U2 249.94,14.67 249.94,14.8 251.97,16.83 B05.T1 | B06.T1 240.41,17.84 241.94,17.84 244.09,20 244.09,21.4 245.75,23.05 B05.R2 246.76,24.19 248.28,24.19 250.44,26.35 250.44,27.75 252.09,29.4 B05.N1 253.11,30.54 254.63,30.54 256.79,32.7 256.79,34.1 258.44,35.75 B04.L2 | B05.J2 246.76,43.24 248.28,43.24 250.44,45.4 250.44,46.8 252.09,48.45 B05.F1
  Bottom 0.381: B04.J2 258.44,42.1 258.32,42.1 256.29,40.07 B05.K1 | v231.01,24.19 231.27,23.94 | v250.19,50.99 249.94,51.24 | 58.42,123.76 58.42,127.83 A20.C2 | 58.42,123.76 57.53,122.87 57.53,121.47 55.88,119.83 A20.F2 | 45.72,126.68 45.72,123.76 44.83,122.87 44.83,121.47 43.18,119.83 A21.F2 | 45.72,126.68 45.72,127.83 A21.C2 | 33.02,126.68 33.02,123.76 32.13,122.87 32.13,121.47 30.48,119.83 A22.F2 | 33.02,126.68 33.02,127.83 A22.C2 | A21.R2 42.16,93.28 40.64,93.28 35.31,87.95 35.31,86.55 33.66,84.9 A22.U2 | 45.72,126.68 33.02,126.68 | v23.37,60.13 22.35,59.12 21.34,59.12 B23.C2 | v38.99,56.2 41.15,58.36 45.34,58.36 B21.C2 | A23.R2 17.14,94.42 17.14,99.25 A23.N2 | A23.C2 20.32,127.83 20.32,123.76 19.43,122.87 19.43,121.47 17.78,119.83 A23.F2 | B23.U2 21.34,14.67 25.53,14.67 26.42,15.56 27.94,15.56 29.46,17.08 B22.T2 | 38.48,17.08 37.97,17.08 37.08,16.19 35.56,16.19 34.04,14.67 B22.U2 | 38.48,17.08 42.16,17.08 B21.T2 | B18.T2 80.26,17.08 76.07,17.08 75.18,16.19 73.66,16.19 72.14,14.67 B19.U2 | B17.T2 92.96,17.08 88.77,17.08 87.88,16.19 86.36,16.19 84.84,14.67 B18.U2 84.07,14.22 81.03,11.18 B18.V2 | B16.T2 105.66,17.08 104.14,17.08 101.98,14.92 97.79,14.92 97.54,14.67 B17.U2 96.77,14.22 93.73,11.18 B17.V2 | v103.63,62.42 100.33,59.12 97.54,59.12 B17.C2 96.52,57.98 96.52,56.58 94.23,54.29 v90.42,54.29 | v118.75,53.15 118.87,53.15 121.92,56.2 121.92,57.98 B15.C2 | A20.U2 59.44,84.52 60.96,84.52 67.56,91.12 67.56,92.52 67.94,92.9 A19.R2 | A19.J2 67.94,111.95 67.94,107.12 A19.L2 | 71.12,123.76 71.12,127.83 A19.C2 | 70.87,123.51 70.23,122.87 70.23,121.47 68.58,119.83 A19.F2
  Bottom 0.381: 71.12,123.76 70.87,123.51 | v77.6,66.86 71.75,61.02 71.75,59.5 B19.C2 70.74,58.36 69.22,56.83 67.69,56.83 66.67,55.82 66.67,55.18 v65.79,54.29 65.41,54.55 59.94,49.09 59.94,45.4 45.97,31.43 42.29,31.43 38.48,27.62 38.48,17.08 | 58.42,123.76 58.55,123.64 70.74,123.64 70.87,123.51 | A13.C2 147.32,127.83 147.32,124.52 145.8,123 145.8,120.84 144.78,119.83 A13.F2 | v153.54,126.3 155.45,128.21 159.64,128.21 A12.C2 161.04,128.97 162.56,130.49 164.08,130.49 164.97,131.38 v166.62,131.38 | v181.61,134.56 180.85,134.56 176.78,130.49 175.26,130.49 173.74,128.97 A11.C2 | v195.58,128.46 194.69,128.46 v192.66,126.43 | v205.23,126.43 208.91,130.11 v209.17,130.11 209.42,130.49 214.25,135.32 v214.38,135.32 | A18.U2 84.84,84.52 86.36,84.52 91.69,89.85 91.69,91.25 93.34,92.9 A17.R2 | A19.U2 72.14,84.52 73.66,84.52 78.99,89.85 78.99,91.25 80.64,92.9 A18.R2 | 83.57,123.51 82.93,122.87 82.93,121.47 81.28,119.83 A18.F2 | 83.57,123.51 83.82,123.76 83.82,127.83 A18.C2 | v140.97,55.05 142.11,55.05 143.89,56.83 145.41,56.83 146.94,58.36 B13.C2 148.34,59.12 149.86,60.64 151.38,60.64 156.08,65.34 v156.08,65.6 | v166.62,55.94 v171.2,60.52 | A14.U2 135.25,84.9 135.25,86.3 140.72,91.76 142.24,91.76 143.76,93.28 A13.R2 | v148.34,86.17 147.96,85.79 147.96,84.9 A13.U2 | A13.J2 144.15,111.95 144.15,110.55 135.51,101.92 133.99,101.92 132.46,100.39 A14.N2 | A17.U2 97.54,84.52 99.06,84.52 104.39,89.85 104.39,91.25 106.05,92.9 A16.R2 107.06,94.04 111.25,94.04 115.32,98.11 116.84,98.11 118.36,99.63 A15.N2 | A17.L2 93.34,107.12 93.34,111.95 A17.J2 | A16.C2 109.22,127.83 109.22,123.76 108.33,122.87 108.33,121.47 106.68,119.83 A16.F2
  Bottom 0.381: v143.38,104.2 143.38,104.84 144.15,105.6 A13.L2 | A16.U2 110.24,84.52 111.76,84.52 117.09,89.85 117.09,91.25 118.75,92.9 A15.R2 | 71.12,123.76 71.25,123.64 83.44,123.64 83.57,123.51 | v184.15,59.88 183.64,59.88 v181.23,57.47 | 55.63,14.22 53.98,14.22 52.83,13.08 52.7,13.08 47.24,13.08 46.1,14.22 B21.U2 45.97,14.1 43.05,11.18 42.93,11.18 B21.V2 | 55.63,14.22 58.67,14.22 B20.U2 | B20.V2 55.63,11.18 55.63,14.1 55.63,14.22 | B16.V2 106.43,11.18 109.47,14.22 B16.U2
I_3CYCLE  (via drill 0.61)
  Top 0.152: v111.89,9.21 72.26,48.83 68.96,48.83 B19.F2 | v177.67,52.77 177.67,52.51 178.94,51.24 184.02,51.24 v185.29,49.97 | v213.74,68.52 214,68.52 214.63,67.88 219.46,67.88 219.84,67.5 | 219.84,67.5 245.62,41.72 246.89,41.72 248.54,40.07 B05.K2 | v262.76,98.74 256.29,105.22 251.97,105.22 249.56,107.63 249.56,108.78 A05.K2 | v235.97,74.49 235.33,74.49 234.95,74.87 233.81,74.87 v229.87,78.8 | 219.84,67.5 v219.96,67.63
  Bottom 0.152: v111.89,9.21 134.11,9.21 v177.67,52.77 | v185.29,49.97 186.69,49.97 200.91,64.2 202.31,64.2 204.34,66.23 209.04,66.23 209.93,67.12 212.34,67.12 v213.74,68.52 | v262.76,98.74 262.25,98.74 248.03,84.52 246,84.52 v235.97,74.49 | v229.87,78.8 229.87,78.68 226.95,75.75 226.95,74.61 v219.96,67.63
I_AC00  (via drill 0.61)
  Top 0.152: v127.51,78.3 130.56,78.3 v134.87,73.98 | v186.18,120.33 186.18,120.21 188.47,117.92 v190.5,117.92 | v215.01,141.29 215.39,141.29 v228.09,128.59 | v230.12,130.62 230.38,130.62 236.22,124.78 236.22,124.65 244.35,116.52 244.35,116.01 250.32,110.05 250.32,109.67 v250.82,109.16 | v275.97,60.52 275.34,60.52 272.16,63.69 271.27,63.69 268.73,66.23 266.83,66.23 v265.18,67.88 | v283.59,89.34 283.59,90.23 282.7,91.12 282.7,91.63 273.56,100.78 273.05,100.78 v264.41,109.41 | v263.14,110.68 262.38,110.68 v258.19,114.87
  Bottom 0.152: v127.51,78.3 106.68,57.47 106.68,56.33 B16.D2 | v134.87,73.98 139.06,73.98 149.99,84.9 150.88,84.9 186.18,120.21 v186.18,120.33 | v190.5,117.92 191.64,117.92 v215.01,141.29 | v228.09,128.59 v230.12,130.62 | v250.82,109.16 251.71,109.16 252.6,110.05 254,110.05 258.19,114.24 | 258.19,114.24 258.7,114.75 258.95,114.75 265.68,121.47 265.94,121.47 274.19,129.73 275.46,129.73 277.11,131.38 A03.B1 | v275.97,60.52 276.99,61.53 277.11,61.53 B03.B1 | v265.18,67.88 265.68,67.88 268.73,70.93 268.73,71.18 268.99,71.44 268.99,71.82 269.11,71.94 269.11,72.58 269.24,72.71 269.24,74.99 v283.59,89.34 | v263.14,110.68 v264.41,109.41 | 258.19,114.24 v258.19,114.87
I_AC01  (via drill 0.61)
  Top 0.152: v193.68,129.67 193.68,129.16 209.42,113.41 209.42,112.52 210.82,111.12 211.2,111.12 215.39,106.93 215.39,105.79 213.36,103.76 | 213.36,103.76 v209.93,107.19 | v261.49,139.19 270.64,130.05 271.53,130.05 274.07,127.51 275.46,127.51 277.11,125.86 A03.D1 | v280.54,55.88 280.54,56.01 v277.24,59.31 | v276.73,66.67 v279.4,64.01 | v285.75,76.71 285.75,77.72 v275.08,88.39 | v269.88,86.23 269.75,86.23 v268.22,87.76 | v254.38,75.69 253.87,75.69 v247.52,82.04 | v243.97,85.34 v243.97,81.41 | v235.33,77.6 235.08,77.6 222.76,89.92 222.76,94.36 213.36,103.76
  Bottom 0.152: v193.68,129.67 191.52,129.67 153.16,91.31 150.24,91.31 121.92,62.99 118.49,62.99 106.81,51.31 106.81,49.91 B16.F2 | v209.93,107.19 210.44,107.19 212.22,108.97 212.22,112.27 223.27,123.32 223.52,123.32 225.17,124.97 225.17,126.87 236.85,138.56 237.87,138.56 238,138.68 248.67,138.68 249.17,139.19 v261.49,139.19 | v280.54,55.88 278.51,55.88 B03.D1 | v277.24,59.31 277.24,59.69 278.89,61.34 278.89,63.5 v279.4,64.01 | v276.73,66.67 276.73,67.69 v285.75,76.71 | v275.08,88.39 274.19,88.39 272.03,86.23 v269.88,86.23 | v268.22,87.76 267.72,87.76 262.64,82.68 261.87,82.68 261.24,82.04 258.19,82.04 257.68,81.53 257.68,78.99 v254.38,75.69 | v247.52,82.04 244.6,82.04 v243.97,81.41 | v243.97,85.34 242.57,85.34 242.44,85.22 242.32,85.22 242.32,85.09 242.19,85.09 242.19,84.96 242.06,84.96 242.06,84.84 241.94,84.84 241.94,84.71 241.81,84.71 241.81,84.58 239.27,82.04 239.14,82.04 239.14,81.92 239.01,81.92 239.01,81.79 238.89,81.79 238.89,81.66 238.76,81.66 238.76,81.53 238.63,81.53 238.63,80.9 v235.33,77.6
I_AC02  (via drill 0.61)
  Top 0.152: v126.11,32.07 116.46,41.72 112.27,41.72 111.51,42.48 107.06,42.48 B16.J2 | v155.07,50.35 158.62,50.35 161.16,47.82 162.18,47.82 v188.98,21.02 | v201.8,33.21 201.8,32.58 207.39,26.99 208.03,26.99 223.77,11.24 224.28,11.24 224.66,10.86 225.68,10.86 226.57,9.97 228.6,9.97 v230.38,8.19 | v307.47,85.41 301.88,91 301.88,92.77 301.24,93.41 301.24,100.9 301.12,101.03 301.12,103.69 289.43,115.38 289.43,115.89 283.46,121.86 281.69,121.86 A03.E1 | v288.29,47.43 284.35,47.43 283.08,48.7 283.08,49.85 281.31,51.63 B03.E1
  Bottom 0.152: v126.11,32.07 131.57,32.07 147.07,47.56 152.27,47.56 v155.07,50.35 | v188.98,21.02 189.61,21.02 v201.8,33.21 | v230.38,8.19 232.92,8.19 244.6,19.88 244.6,20.64 246.51,22.54 248.54,22.54 252.98,26.99 254,26.99 277.37,50.35 278.64,50.35 280.29,52.01 B03.E1 | v307.47,85.41 307.47,72.83 305.82,71.18 305.82,70.67 303.53,68.39 303.53,66.99 301.12,64.58 301.12,62.8 296.8,58.48 296.8,57.09 295.78,56.07 295.78,52.9 290.96,48.07 288.93,48.07 v288.29,47.43
I_AC03  (via drill 0.61)
  Top 0.152: v118.49,45.53 120.02,45.53 140.97,24.57 142.11,24.57 153.54,13.14 156.21,13.14 156.46,12.89 159.13,12.89 v164.08,7.94 | v190.12,28.64 192.28,28.64 v219.2,1.71 | v244.47,18.61 247.27,18.61 253.37,12.51 255.27,12.51 258.19,9.59 259.33,9.59 259.59,9.34 260.73,9.34 v261.49,8.57 | v275.72,28.26 274.83,28.26 273.56,29.53 273.56,34.86 v273.05,35.37 | B03.H1 281.31,45.28 281.43,45.15 v281.43,43.75 281.81,43.5 v287.27,38.04 | v276.86,108.9 282.57,103.19 282.57,103.06 284.48,101.16 284.61,101.16 291.59,94.17 291.59,90.61 307.72,74.49 307.72,68.14 v309.12,66.74
  Bottom 0.152: v118.49,45.53 109.86,36.89 107.06,36.89 B16.L2 | v164.08,7.94 167.13,7.94 169.04,9.84 171.32,9.84 v190.12,28.64 | v219.2,1.71 219.96,0.95 224.79,0.95 226.06,2.22 226.69,2.22 227.33,2.86 228.22,2.86 230.38,5.02 230.89,5.02 v244.47,18.61 | v261.49,8.57 264.16,8.57 275.72,20.13 v275.72,28.26 | v273.05,35.37 v281.43,43.75 | v276.86,108.9 280.67,112.71 280.67,115.13 A03.H1 | v309.12,66.74 309.12,63.06 302.13,56.07 302.13,52.9 v287.27,38.04
I_AC04  (via drill 0.61)
  Top 0.152: v105.28,40.39 105.28,35.94 105.92,35.31 105.92,30.86 B16.N2 | v109.98,49.28 110.62,48.64 v110.62,47.62 111,47.75 125.48,33.27 v125.98,33.27 | v119.38,60.33 121.41,62.36 v118.75,65.02 | v221.49,133.99 217.42,138.05 210.82,138.05 209.8,139.06 209.8,139.45 207.77,141.48 200.53,141.48 199.39,140.34 v199.01,140.08 | v232.54,141.86 233.17,141.86 v237.24,137.79 | v249.56,138.43 271.91,116.08 272.8,116.08 274.07,114.81 275.46,114.81 277.11,113.16 A03.J1 | v288.54,30.73 288.42,30.86 288.42,33.91 281.18,41.15 280.67,41.15 279.4,42.42 278.51,42.42 B03.J1 | v262.76,10.03 v267.59,10.03 | v256.67,4.32 246.51,4.32 v241.43,9.4 | v235.46,7.37 234.82,7.37 v229.87,12.32 | v226.69,9.14 224.79,9.14 208.53,25.4 207.14,25.4 206.63,25.91 203.84,25.91 199.64,30.1 197.61,30.1 v196.47,31.24 | v180.97,26.8 180.97,27.05 173.61,34.42 173.35,34.42 172.47,35.31 172.47,35.56 160.91,47.12 155.57,47.12 v149.22,53.47